# EAGLE design design (EAGLE 7.3.0)
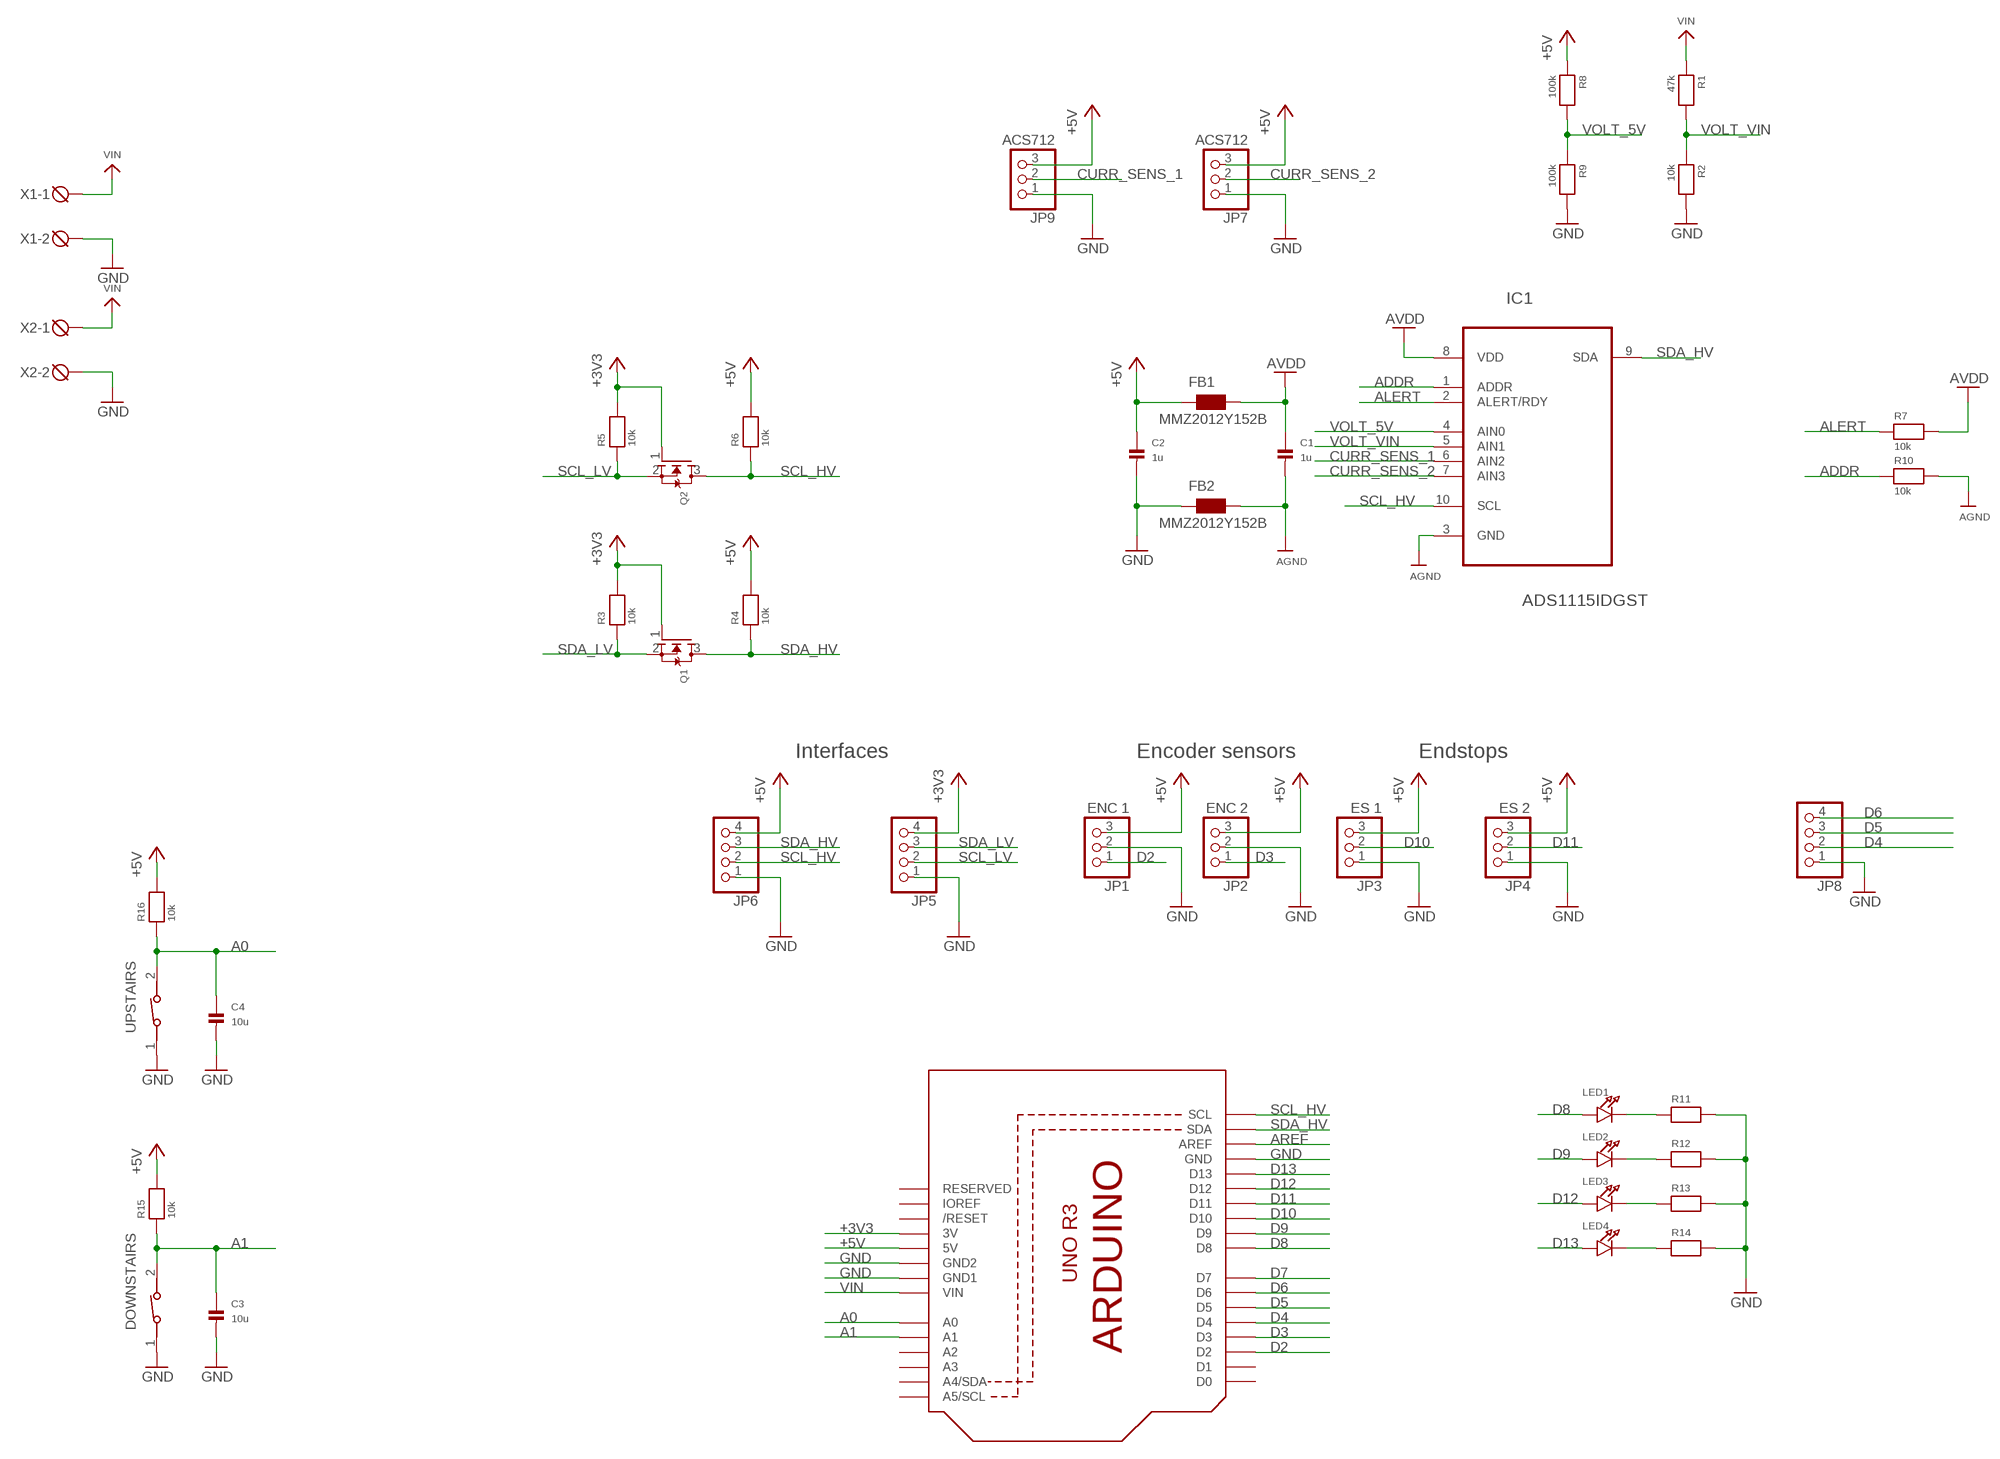
[diagram p0: schematic, sheet 1]

## Parts
C1  1u  CAP_CERAMIC0805  [0805]
C2  1u  CAP_CERAMIC0805  [0805]
C3  10u  CAP_CERAMIC0805  [0805]
C4  10u  CAP_CERAMIC0805  [0805]
DOWNSTAIRS  434111043826  [434111043826]
FB1  MMZ2012Y152B  WE-CBF_0805  [0805]
FB2  MMZ2012Y152B  WE-CBF_0805  [0805]
IC1  ADS1115IDGST  [SOP50P490X110-10N]
JP1  ENC 1  HEADER-1X3ROUND  [1X03_ROUND]
JP2  ENC 2  HEADER-1X3ROUND  [1X03_ROUND]
JP3  ES 1  HEADER-1X3ROUND  [1X03_ROUND]
JP4  ES 2  HEADER-1X3ROUND  [1X03_ROUND]
JP5  HEADER-1X4ROUND  [1X04_ROUND]
JP6  HEADER-1X4ROUND  [1X04_ROUND]
JP7  ACS712  HEADER-1X3ROUND  [1X03_ROUND]
JP8  HEADER-1X4ROUND  [1X04_ROUND]
JP9  ACS712  HEADER-1X3ROUND  [1X03_ROUND]
LED1  LED0805  [CHIPLED_0805]
LED2  LED0805  [CHIPLED_0805]
LED3  LED0805  [CHIPLED_0805]
LED4  LED0805  [CHIPLED_0805]
Q1  MOSFET-NWIDE  [SOT23-WIDE]
Q2  MOSFET-NWIDE  [SOT23-WIDE]
R1  47k  RESISTOR0603  [0603]
R2  10k  RESISTOR0603  [0603]
R3  10k  RESISTOR0603  [0603]
R4  10k  RESISTOR0603  [0603]
R5  10k  RESISTOR0603  [0603]
R6  10k  RESISTOR0603  [0603]
R7  10k  RESISTOR0603  [0603]
R8  100k  RESISTOR0603  [0603]
R9  100k  RESISTOR0603  [0603]
R10  10k  RESISTOR0603  [0603]
R11  RESISTOR0603  [0603]
R12  RESISTOR0603  [0603]
R13  RESISTOR0603  [0603]
R14  RESISTOR0603  [0603]
R15  10k  RESISTOR0603  [0603]
R16  10k  RESISTOR0603  [0603]
U1  ARDUINOR3NODIM  [ARDUINOR3-NODIM]
UPSTAIRS  434111043826  [434111043826]
X1  DG3XX-02-5.0  [DG306-5.0-02P]
X2  DG3XX-02-5.0  [DG306-5.0-02P]

## Nets
+3V3: JP5.4 Q1.1(G) Q2.1(G) R3.2 R5.2 U1.3V
+5V: C2.1 FB1.1 JP1.3 JP2.3 JP3.3 JP4.3 JP6.4 JP7.3 JP9.3 R4.2 R6.2 R8.1 R15.2 R16.2 U1.5V
A0: C4.1 R16.1 U1.A0 UPSTAIRS.2
A1: C3.1 DOWNSTAIRS.2 R15.1 U1.A1
ADDR: IC1.1(ADDR) R10.1
AGND: C1.2 FB2.2 IC1.3(GND) R10.2
ALERT: IC1.2(ALERT/RDY) R7.1
AREF: U1.AREF
AVDD: C1.1 FB1.2 IC1.8(VDD) R7.2
CURR_SENS_1: IC1.6(AIN2) JP9.2
CURR_SENS_2: IC1.7(AIN3) JP7.2
D2: JP1.1 U1.D2
D3: JP2.1 U1.D3
D4: JP8.2 U1.D4
D5: JP8.3 U1.D5
D6: JP8.4 U1.D6
D7: U1.D7
D8: LED1.A U1.D8
D9: LED2.A U1.D9
D10: JP3.2 U1.D10
D11: JP4.2 U1.D11
D12: LED3.A U1.D12
D13: LED4.A U1.D13
GND: C2.2 C3.2 C4.2 DOWNSTAIRS.1 FB2.1 JP1.2 JP2.2 JP3.1 JP4.1 JP5.1 JP6.1 JP7.1 JP8.1 JP9.1 R2.2 R9.2 R11.2 R12.2 R13.2 R14.2 U1.GND U1.GND1 U1.GND2 UPSTAIRS.1 X1.2 X2.2
N$1: LED1.C R11.1
N$2: LED2.C R12.1
N$3: LED3.C R13.1
N$4: LED4.C R14.1
SCL_HV: IC1.10(SCL) JP6.2 Q2.3(D) R6.1 U1.SCL
SCL_LV: JP5.2 Q2.2(S) R5.1
SDA_HV: IC1.9(SDA) JP6.3 Q1.3(D) R4.1 U1.SDA
SDA_LV: JP5.3 Q1.2(S) R3.1
VIN: R1.1 U1.VIN X1.1 X2.1
VOLT_5V: IC1.4(AIN0) R8.2 R9.1
VOLT_VIN: IC1.5(AIN1) R1.2 R2.1
Unconnected: U1.A2 U1.A3 U1.A4(A4/SDA) U1.A5(A5/SCL) U1.D0 U1.D1 U1.IOREF U1.RESERVED U1.RESET(/RESET)

## Notes on the sheet
- Interfaces | Encoder sensors | Endstops

## Library data of the parts
C1-C4 = microbuilder:CAP_CERAMIC: Ceramic Capacitors 0402 - 0402 Surface Mount Capacitors 16pF 50V 5% [Digikey: 445-4899-2-ND] 18pF 50V 5% [Digikey: 490-1281-2-ND] 22pF 50V 5% [Digikey: 490-1283-2-ND] 68pF 50V 5% [Digikey: 490-1289-2-ND] 0.1uF 10V 10% [Digikey: 490-1318-2-ND] 1.0uF 6.3V 10% [Digikey: 490-1320-2-ND] 0603 - 0603 Surface Mount Capacitors 16 pF 50V 5% [Digikey: 445-5051-2-ND] 22 pF 50V [Digikey: PCC220ACVTR-ND] 33 pF 50V 5% [Digikey: 490-1415-1-ND] 56pF 50V 5% [Digikey: 490-1421-1-ND] 220pF 50V 5% [Digikey: 445-1285-1-ND] 680 pF 50V 2200 pF 50V 5% C0G [Digikey: 445-1297-1-ND] 5600 pF 100V 5% X7R [Digikey: 478-3711-1-ND] 0.1 µF 25V 10% [Digikey: PCC2277TR-ND] 0.22 µF 16V 10% X7R [Digikey: 445-1318-1-ND] 1.0 µF 25V 10% [Digikey: 445-5146-2-ND] 0603 - RF Specific 3pF 250V +/-0.1pF RF [Digikey: 712-1347-1-ND] 18 pF 250V 5% [Digikey: 478-3505-1-ND or 712-1322-1-ND] 56 pF 250V 5% C0G RF [Digikey: 490-4867-1-ND] 68 pF 250V RF [Digikey: 490-4868-1-ND] 0805 - 0805 Surface Mount Capacitors 220 pF 250V 2% RF Ceramic Capacitor [Digikey: 712-1398-1-ND] 1000 pF 50V 2% NP0 Ceramic Capacitor [Digikey: 478-3760-1-ND] 0.1 µF 25V 10% Ceramic Capacitor [Digikey: PCC1828TR-ND] 1.0 µF 16V 10% Ceramic Capacitor[Digikey: 490-1691-2-ND] 10.0 µF 10V 10% Ceramic Capacitor[Digikey: 709-1228-1-ND] 10.0 uF 16V 10% Ceramic Capacitor [Digikey: 478-5165-2-ND] 47 uF 6.3V 20% Ceramic Capacitor [Digikey: 587-1779-1-ND or 399-5506-1-ND] 1206 - 1206 Surface Mount Capacitors 47uF 10V 20% Ceramic Capacitor [Digikey: 490-5528-1-ND or 399-5508-1-ND or 445-6010-1-ND] 100uF 6.3V -20%, +80% Y5V Ceramic Capacitor (Digikey: 490-4512-1-ND, Mouser: 81-GRM31CF50J107ZE1L)
DOWNSTAIRS UPSTAIRS = Eagle_SWITCHES (rev18c):434111043826: 6.0x3.5 mm SMD WS-TASV <http://katalog.we-online.de/media/images/v2/Family_WS-TASV_6.0x3.jpg> Details see: http://katalog.we-online.de/em/datasheet/4341x1xxx8x6.pdf 2015 (C) Wurth Elektronik
FB1 FB2 = wuerth-elektronik:WE-CBF: SMD EMI Suppression Ferrite Beads - excellent anti-EMI properties - low DCR - impedances till 3000 ohms - rated current up to 6 A
IC1 = ADS1115IDGST:ADS1115IDGST: Analog-to-Digital Converter with Internal Reference; AVAILABILITY: Unavailable; DESCRIPTION: 16-Bit ADC with Integrated MUX, PGA, Comparator, Oscillator, and Reference 10-VSSOP -40 to 125; MF: Texas Instruments; MP: ADS1115IDGST; PACKAGE: MSOP-10 Texas Instruments; PRICE: None
JP1-JP4 JP7 JP9 = microbuilder:HEADER-1X3: PIN HEADER
JP5 JP6 JP8 = microbuilder:HEADER-1X4: PIN HEADER
LED1-LED4 = microbuilder:LED: LED 0603 - 0603 Surface Mount Package 2mA: Green LED - Low Power (3.9mcd, 2ma, 1.7Vf) - Digikey: 475-2709-2-ND Orange LED - Low Power (9.8mcd, 2ma, 1.8Vf) - Digikey: 475-1194-2-ND Red LED - Low Power (5mcd, 2ma, 1.8Vf) - Digikey: 475-1195-2-ND Yellow LED - Low Power (7mcd, 2ma, 1.8Vf) - Digikey: 475-1196-2-ND 5mA: Blue LED - Low Power (17mcd, 5ma, 2.9Vf) - Digikey: LNJ937W8CRACT-ND 0805 - 0805 Surface Mount Package 2mA: Red LED (8.8mcd, 2mA, 1.8Vf, Clear) - Low Power [Digikey: 475-2510-1-ND] Green LED (5mcd, 2mA, 1.8Vf, Clear) - Low Power [Digikey: 475-2730-1-ND] Yellow LED (11.3mcd, 2mA, 1.8Vf, Clear) - Low Power [Digikey: 475-2555-1-ND] 20mA: Red LED (104mcd, 20mA, Diffused) - LS R976 [Digikey: 475-1278-6-ND] Red LED (12mcd, 20mA, 2.0Vf, Clear) - APT2012EC [Digikey: 754-1128-1-ND] Green LED (15mcd, 20mA, 2.2Vf, Clear) - APT2012GC [Digikey: 754-1131-1-ND] Orange LED (160mcd, 20mA, 2.1Vf, Clear) - APT2012SECK [Digikey: 754-1130-1-ND] 1206 - 1206 Surface Mount Package Green LED (26mcd, 20mA, Diffused) - LG N971 [Digikey: 475-1407-6-ND] Red LED (15mcd, 20mA, Diffused) - LH N974 [Digikey: 475-1416-6-ND]
Q1 Q2 = microbuilder:MOSFET-N: N-Channel Mosfet LEGEND VDS: Voltage Drain-Source ID: Drain Current RDS(ON): Drain-Source On-State Resistance VGS(TH): Gate-Source Threshold Voltage CISS: Drain-Source Input Capacitance SOT-23 Name VDS ID RDS(ON) VGS(TH) CISS Order Number 2N7002E 60V 260mA 2.5 Ohm 2.5V @ 250uA 26.7pF @ 25V 2N7002ET1GOSTR-ND BSH103 30V 850mA 400 mOhm 400mV @ 1mA 83pF @ 24V BSH103,235-ND BSS138 60V 320mA 1.6 Ohm 1.5V @ 250uA 50pF @ 10V Mouser: 771-BSS138PW115 DMN2075U-7 20V 4.2A 38 mOhm 1V @ 250 uA 594.3pF @ 10V DMN2075U-7DICT-ND * BSS138 good choice for I2C level-shifting
R1-R16 = microbuilder:RESISTOR: Resistors 0402 - 0402 Surface Mount Package 22 Ohm 1% 1/16W [Digikey: 311-22.0LRTR-ND] 33 Ohm 5% 1/16W 1.0K 5% 1/16W 1.5K 5% 1/16W 2.0K 1% 1/16W 10.0K 1% 1/16W [Digikey: 311-10.0KLRTR-ND] 10.0K 5% 1/16W [Digikey: RMCF0402JT10K0TR-ND] 12.1K 1% 1/16W [Digikey: 311-22.0LRTR-ND] 100.0K 5% 1/16W 0603 - 0603 Surface Mount Package 0 Ohm 1/10 Watt 1% Resistor 15 Ohm 1/10 Watt 1% Resistor 33 Ohm 1/10 Watt 1% Resistor 49.9 Ohm 1/10 Watt 1% Resistor 100 Ohm 1/10 Watt 1% Resistor 150 Ohm 1/10 Watt 1% Resistor 240 Ohm 1/10 Watt 1% Resistor 390 Ohm 1/10 Watt 1% Resistor 560 Ohm 1/10 Watt 1% Resistor 680 Ohm 1/10 Watt 1% Resistor 750 Ohm 1/10 Watt 1% Resistor 1.0K Ohm 1/10 Watt 1% Resistor 1.5K Ohm 1/10 Watt 1% Resistor 2.0K Ohm 1/10 Watt 1% Resistor 2.2K Ohm 1/10 Watt 1% Resistor 3.3K Ohm 1/10 Watt 1% Resistor 4.7K Ohm 1/10 Watt 1% Resistor 10.0K Ohm 1/10 Watt 1% Resistor 12.0K Ohm 1/10 Watt 1% Resistor 12.1K Ohm 1/10 Watt 1% Resistor 20.0K Ohm 1/10 Watt 1% Resistor 33.0K Ohm 1/10 Watt 1% Resistor 100.0K Ohm 1/10 Watt 1% Resistor 0805 - 0805 Surface Mount Package 0 Ohm 1/8 Watt 1% Resistor 33 Ohm 1/8 Watt 1% Resistor 100 Ohm 1/8 Watt 1% Resistor 150 Ohm 1/8 Watt 1% Resistor 200 Ohm 1/8 Watt 1% Resistor 240 Ohm 1/8 Watt 1% Resistor 330 Ohm 1/8 Watt 1% Resistor 390 Ohm 1/8 Watt 1% Resistor 470 Ohm 1/8 Watt 1% Resistor 1.0K Ohm 1/8 Watt 1% Resistor 1.5K Ohm 1/8 Watt 1% Resistor 2.0K Ohm 1/8 Watt 1% Resistor 4.7K Ohm 1/8 Watt 1% Resistor 5.1K Ohm 1/8 Watt 1% Resistor 5.6K Ohm 1/8 Watt 1% Resistor 10.0K Ohm 1/8 Watt 1% Resistor 22.0K Ohm 1/8 Watt 1% Resistor 33.0K Ohm 1/8 Watt 1% Resistor 100K Ohm 1/8 Watt 1% Resistor 1206 - 1206 Surface Mount Package 2012 - 2010 Surface Mount Package 0.11 Ohm 1/2 Watt 1% Resistor - Digikey: RHM.11UCT-ND
U1 = microbuilder:ARDUINOR3: This is a new object for the new Arduino R3 - with extra pins that you may want to use (such as IOref, and duplicated A4/A5
X1 X2 = degson:DG3XX-02: DG350-3.5-02P DG306-5.0-02P

## Board
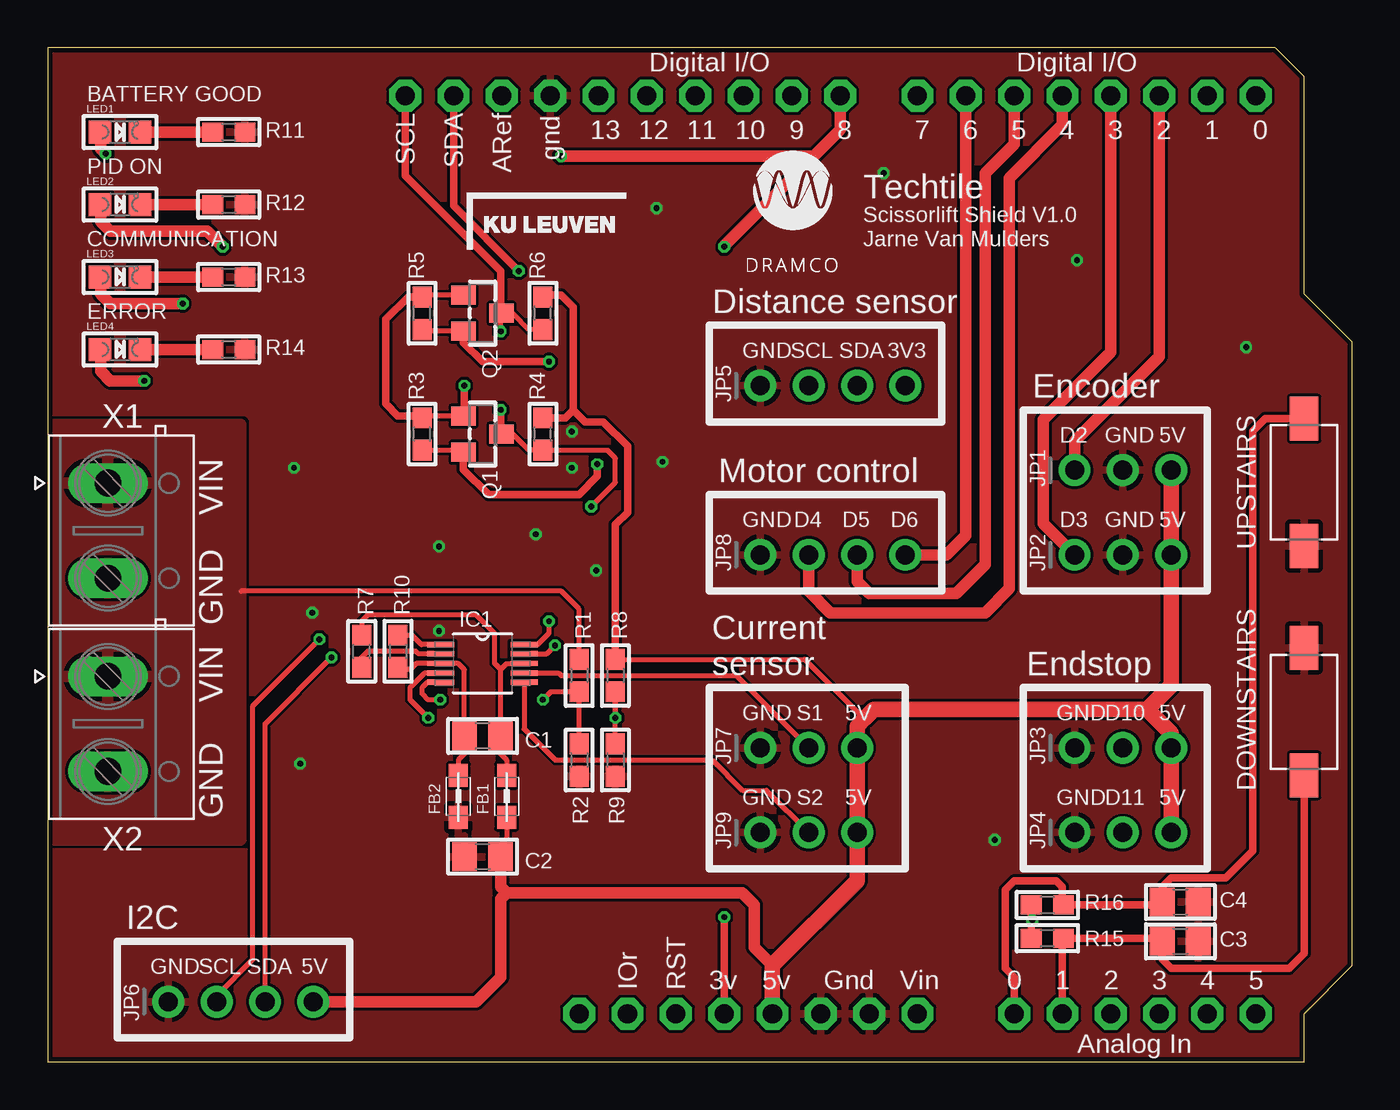
[diagram p1: board, top side]
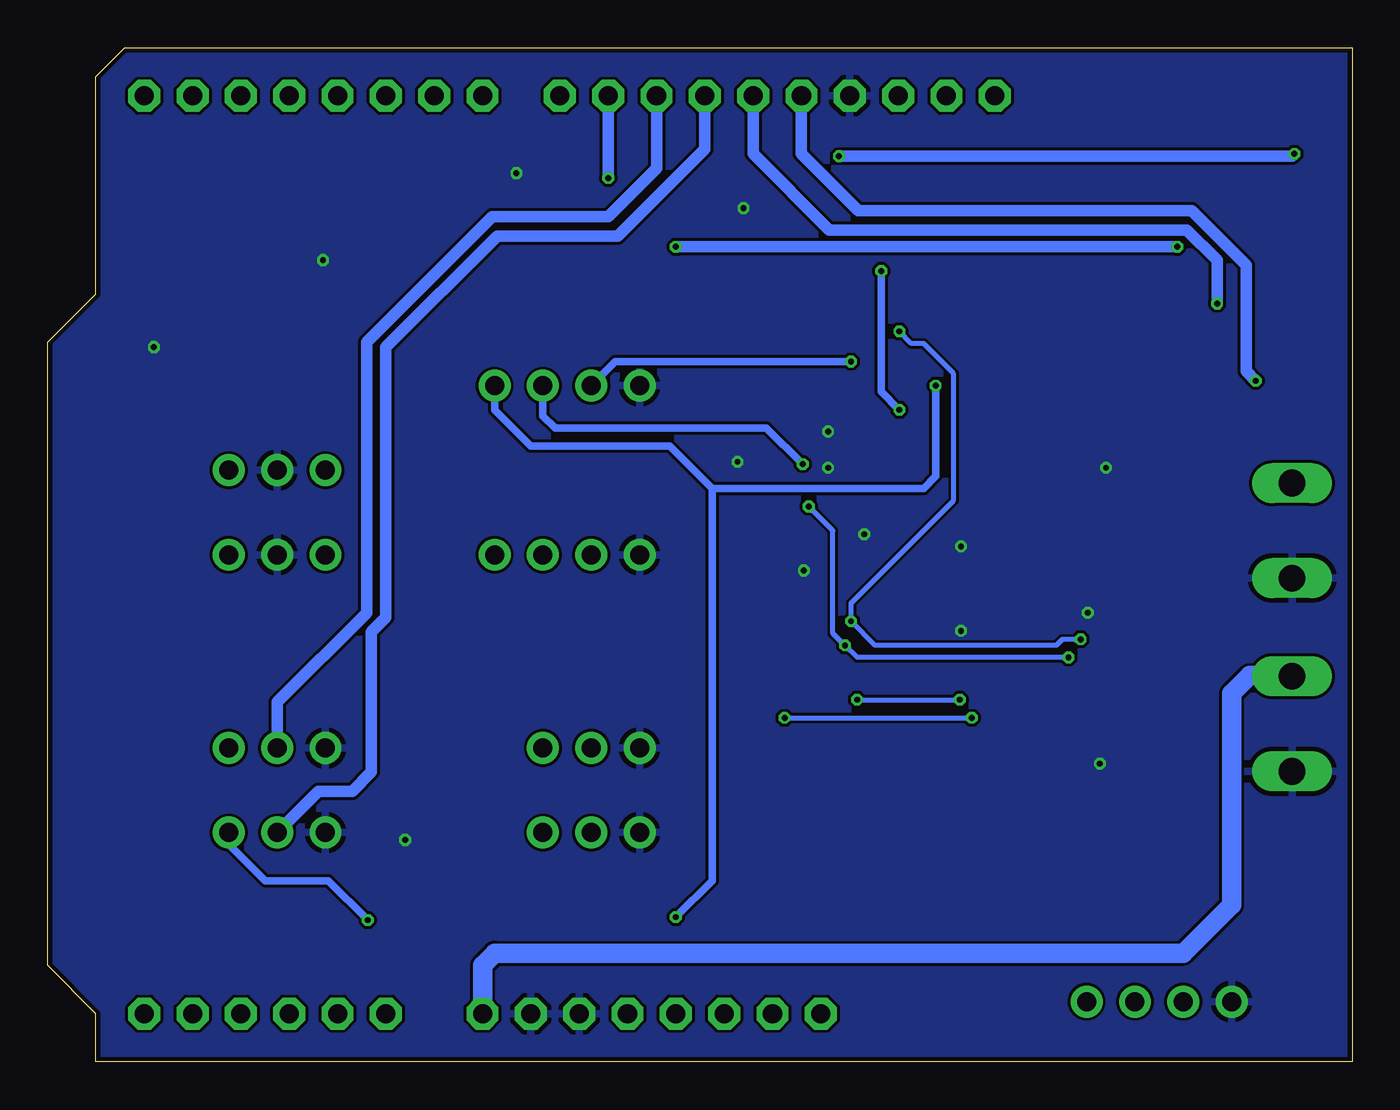
[diagram p2: board, bottom side, seen from below]

Size 68.58 x 53.34 mm. Coordinates in mm from the lower left corner, seen from the top.
Outline: 0,0 66.04,0 66.04,2.54 68.58,5.08 68.58,37.85 66.04,40.39 66.04,51.82 64.52,53.34 0,53.34 0,0
Copper layers (1*16): Top 0.035mm / dielectric 1.5mm / Bottom 0.035mm
Design rules "SeeedStudio_2layer_DRU_no_angle_20140221-2": minimum track width 6mil, minimum drill 12mil, track to track 6mil, track to pad 6mil, pad to pad 6mil, via to via 6mil, smd to smd 0mil, copper to edge 10mil, drill to drill 10mil, minimum pad ring 10mil, minimum via ring 6mil, stop-mask expansion 2mil, vias tented up to drill 100mil, thermal gap 10mil

### Footprints (pad centres in the part's own frame; a part is rotated, then mirrored left to right if it is on the bottom)
0805 = smd 1.3 x 1.5: 1 -0.95,0; 2 0.95,0
434111043826 = smd 2.3 x 1.5: 1 -3.35,0; 2 3.35,0
0805' = smd 1.2 x 1: 1 -1.1,0; 2 1.1,0
SOP50P490X110-10N = smd 1.422 x 0.279: 1 -2.184,0.991; 2 -2.184,0.508; 3 -2.184,0; 4 -2.184,-0.508; 5 -2.184,-0.991; 6 2.184,-0.991; 7 2.184,-0.508; 8 2.184,0; 9 2.184,0.508; 10 2.184,0.991
1X03_ROUND = drill 1 pad 1.676: 1 -2.54,0; 2 0,0; 3 2.54,0
1X04_ROUND = drill 1 pad 1.676: 1 -3.81,0; 2 -1.27,0; 3 1.27,0; 4 3.81,0
CHIPLED_0805 = smd 1.2 x 1.2: A 0,-1.05; C 0,1.05
SOT23-WIDE = smd 1 x 1.27: 1 -0.95,-1; 2 0.95,-1; 3 0,1
0603 = smd 1.1 x 1: 1 -0.85,0; 2 0.85,0
ARDUINOR3-NODIM = drill 1 pad 1.676 octagon: 3V 35.56,2.54; 5V 38.1,2.54; A0 50.8,2.54; A1 53.34,2.54; A2 55.88,2.54; A3 58.42,2.54; A4 60.96,2.54; A5 63.5,2.54; AREF 23.876,50.8; D0 63.5,50.8; D1 60.96,50.8; D2 58.42,50.8; D3 55.88,50.8; D4 53.34,50.8; D5 50.8,50.8; D6 48.26,50.8; D7 45.72,50.8; D8 41.656,50.8; D9 39.116,50.8; D10 36.576,50.8; D11 34.036,50.8; D12 31.496,50.8; D13 28.956,50.8; GND 26.416,50.8; GND1 43.18,2.54; GND2 40.64,2.54; IOREF 30.48,2.54; RESERVED 27.94,2.54; RESET 33.02,2.54; SCL 18.796,50.8; SDA 21.336,50.8; VIN 45.72,2.54
DG306-5.0-02P = drill 1.4 long: 1 -2.5,0; 2 2.5,0

### Placement (x,y rotation side)
C1  22.86,17.14 180 top
C2  22.86,10.79 180 top
C3  59.53,6.35 0 top
C4  59.53,8.41 0 top
DOWNSTAIRS  66.04,18.41 270 top
FB1  MMZ2012Y152B  [0805']  24.13,13.97 90 top
FB2  MMZ2012Y152B  [0805']  21.59,13.97 90 top
IC1  22.86,20.95 0 top
JP1  56.52,31.11 0 top
JP2  56.52,26.67 0 top
JP3  56.52,16.51 0 top
JP4  56.52,12.06 0 top
JP5  41.27,35.56 0 top
JP6  10.16,3.17 0 top
JP7  40.01,16.51 0 top
JP8  41.27,26.67 0 top
JP9  40.01,12.06 0 top
LED1  3.81,48.9 270 top
LED2  3.81,45.09 270 top
LED3  3.81,41.27 270 top
LED4  3.81,37.47 270 top
Q1  22.86,33.02 270 top
Q2  22.86,39.37 270 top
R1  27.94,20.32 270 top
R2  27.94,15.88 270 top
R3  19.68,33.02 90 top
R4  26.04,33.02 90 top
R5  19.68,39.37 90 top
R6  26.04,39.37 90 top
R7  16.51,21.59 90 top
R8  29.84,20.32 270 top
R9  29.84,15.88 270 top
R10  18.41,21.59 270 top
R11  9.53,48.9 0 top
R12  9.53,45.09 0 top
R13  9.53,41.27 0 top
R14  9.53,37.47 0 top
R15  52.55,6.51 180 top
R16  52.55,8.26 180 top
U1  0,0 0 top
UPSTAIRS  66.04,30.48 90 top
X1  3.17,27.94 270 top
X2  3.17,17.78 270 top

### Tracks (layer width: path | path; a pad name or v marks a point on that pad's centre or on a via)
+3V3  (via drill 0.31)
  Top 0.254: Q1.1 19.79,33.97 R3.2 | Q2.1 19.79,40.32 R5.2
  Top 0.406: R5.2 18.95,40.22 17.78,39.05 17.78,34.61 18.41,33.97 19.58,33.97 R3.2 | v35.56,7.62 U1.3V | v21.91,35.56 21.91,34.02 Q1.1
  Bottom 0.406: JP5.4 45.09,34.29 43.18,32.38 35.88,32.38 33.66,30.16 | 33.66,30.16 33.66,9.53 v35.56,7.62 | 33.66,30.16 22.54,30.16 21.91,30.8 v21.91,35.56
+5V  (via drill 0.31)
  Top 0.254: FB1.1 24.13,11.75 23.81,11.43 C2.1 | R8.1 39.79,21.17 42.93,18.03
  Top 0.406: R8.1 29.84,28.26 30.48,28.89 30.48,32.38 29.21,33.66 28.26,33.66 27.62,34.29 | R4.2 27.2,33.87 27.62,34.29 | 27.62,34.29 27.62,39.69 26.99,40.32 26.14,40.32 R6.2 | R16.2 51.7,7.46 | 51.7,7.46 R15.2 | v51.75,7.46 51.7,7.46
  Top 0.61: 38.1,5.08 37.15,6.03 37.15,8.26 36.51,8.89 24.13,8.89 | 24.13,8.89 23.81,9.21 C2.1 | JP6.4 22.54,3.17 23.81,4.45 23.81,8.57 24.13,8.89
  Top 0.813: U1.5V 38.1,5.08 42.55,9.53 JP9.3 JP7.3 42.55,17.65 42.93,18.03 43.43,18.54 57.78,18.54 | JP4.3 JP3.3 59.05,17.27 57.78,18.54 | JP1.3 JP2.3 59.05,19.81 57.78,18.54
  Bottom 0.406: JP4.3 59.05,11.43 57.15,9.53 53.82,9.53 v51.75,7.46
A0
  Top 0.406: U1.A0 50.8,4.45 50.32,4.92 50.32,9.05 50.8,9.53 53.02,9.53 53.34,9.21 53.34,8.31 R16.1 58.42,8.26 C4.1 58.58,9.21 59.05,9.68 61.91,9.68 63.34,11.11 63.34,33.18 63.99,33.83 UPSTAIRS.2
A1
  Top 0.406: U1.A1 53.34,6.45 R15.1 58.42,6.51 C3.1 58.58,5.39 59.05,4.92 65.25,4.92 66.04,5.71 DOWNSTAIRS.2
ADDR
  Top 0.254: IC1.1 19.65,21.95 19.15,22.44 R10.1
AGND
  Top 0.254: R10.2 18.52,20.64 19.05,20.64 19.37,20.95 IC1.3 21.59,20.95 21.91,20.64 C1.2 21.91,16.2 21.59,15.88 FB2.2
ALERT
  Top 0.254: IC1.2 19.49,21.46 19.37,21.59 16.83,21.59 16.51,21.27 R7.1
AVDD
  Top 0.254: 23.81,20.64 C1.1 23.81,16.2 24.13,15.88 FB1.2 | 23.81,20.64 24.13,20.95 IC1.8 | 23.81,20.64 23.5,20.95 23.5,22.54 22.54,23.5 16.83,23.5 16.51,23.18 R7.2
CURR_SENS_1
  Top 0.254: IC1.6 25.04,17.5 26.67,15.88 34.92,15.88 36.51,14.29 37.78,14.29 JP9.2
CURR_SENS_2
  Top 0.254: IC1.7 26.86,20.45 26.99,20.32 36.2,20.32 JP7.2
D2
  Top 0.61: JP1.1 53.98,32.64 58.42,37.08 U1.D2
D3
  Top 0.61: U1.D3 55.88,37.34 52.32,33.78 52.32,28.32 JP2.1
D4
  Top 0.61: JP8.2 40.01,24.77 41.15,23.62 49.28,23.62 50.55,24.89 50.55,46.48 53.34,49.28 U1.D4
D5
  Top 0.61: JP8.3 42.55,25.27 43.18,24.64 47.75,24.64 49.28,26.16 49.28,46.74 50.8,48.26 U1.D5
D6
  Top 0.61: U1.D6 48.26,27.69 47.24,26.67 JP8.4
D8  (via drill 0.31)
  Top 0.61: U1.D8 41.66,49.02 40.26,47.62 v26.99,47.62 | v3.05,47.75 2.79,48.01 2.79,48.86 LED1.A
  Bottom 0.61: v3.05,47.75 3.17,47.62 v26.99,47.62
D9  (via drill 0.31)
  Top 0.61: v39.12,46.48 35.56,42.93 v35.56,42.86 | LED2.A 2.79,45.05 2.79,44.2 3.3,43.69 8.38,43.69 v9.21,42.86
  Bottom 0.61: U1.D9 v39.12,46.48 | v9.21,42.86 v35.56,42.86
D10
  Bottom 0.61: U1.D10 36.58,46.99 39.12,44.45 45.21,44.45 51.82,37.85 51.82,23.62 56.52,18.92 JP3.2
D11
  Bottom 0.61: U1.D11 34.04,48.01 38.61,43.43 44.96,43.43 50.8,37.59 50.8,23.37 51.56,22.61 51.56,15.24 52.58,14.22 54.36,14.22 JP4.2
D12  (via drill 0.31)
  Top 0.61: v7.11,39.88 3.3,39.88 2.79,40.39 2.79,41.24 LED3.A
  Bottom 0.61: U1.D12 31.5,47.75 27.5,43.75 8.7,43.75 7.11,42.16 v7.11,39.88
D13  (via drill 0.31)
  Top 0.61: v5.08,35.81 3.3,35.81 2.79,36.32 2.79,37.43 LED4.A
  Bottom 0.61: U1.D13 28.96,47.75 25.97,44.77 8.45,44.77 5.59,41.91 5.59,36.32 v5.08,35.81
GND  (via drill 0.31)
  other vias: 12.95,31.24 62.99,37.59 54.1,42.16 43.94,46.74 49.78,11.68 13.27,15.68 32,44.89 27.56,31.24 27.56,33.15 32.32,31.56 25.65,27.75 13.91,23.62 20.57,27.11 28.83,25.84 20.57,22.67
  pour Bottom: -7.62,63.5 76.83,63.5 76.83,-7.62 -7.62,-7.62
  pour Top (rank 6): -12.06,69.22 87.63,69.22 87.63,-19.05 -12.06,-19.05
N$1
  Top 0.61: R11.1 LED1.C
N$2
  Top 0.61: R12.1 LED2.C
N$3
  Top 0.61: R13.1 LED3.C
N$4
  Top 0.61: R14.1 LED4.C
SCL_HV  (via drill 0.31)
  Top 0.254: R6.1 25.3,38.52 24.45,39.37 Q2.3 23.81,39.32 v23.81,38.42 | JP6.2 8.89,3.49 10.79,5.4 10.79,18.73 v14.29,22.23 | v26.35,23.18 26.35,22.54 25.76,21.95 IC1.10
  Top 0.406: U1.SCL 18.8,46.61 23.81,41.59 23.81,39.42 Q2.3
  Bottom 0.254: v14.29,22.23 15.24,22.23 15.56,21.91 25.08,21.91 v26.35,23.18 26.35,24.13 20.95,29.53 20.95,36.2 22.54,37.78 23.18,37.78 v23.81,38.42
SCL_LV  (via drill 0.31)
  Top 0.254: Q2.2 19.79,38.42 R5.1
  Top 0.406: Q2.2 21.86,37.83 22.86,36.83 v26.35,36.83
  Bottom 0.406: v26.35,36.83 38.73,36.83 JP5.2
SDA_HV  (via drill 0.31)
  Top 0.254: Q1.3 24.45,33.02 25.3,32.17 R4.1 29.43,32.17 29.84,31.75 29.84,30.48 v28.57,29.21 | JP6.3 11.43,17.78 v14.92,21.27 | IC1.9 26.23,21.46 v26.67,21.91
  Top 0.406: U1.SDA 21.34,45.02 v24.77,41.59 | v23.81,34.29 23.81,33.07 Q1.3
  Bottom 0.254: v14.92,21.27 26.04,21.27 v26.67,21.91 27.3,22.54 27.3,27.94 v28.57,29.21
  Bottom 0.406: v24.77,41.59 24.77,35.24 v23.81,34.29
SDA_LV  (via drill 0.31)
  Top 0.254: R3.1 21.76,32.17 Q1.2
  Top 0.406: Q1.2 21.86,31.16 23.18,29.84 27.94,29.84 28.89,30.8 v28.89,31.43
  Bottom 0.406: JP5.3 42.55,33.97 41.91,33.34 30.8,33.34 v28.89,31.43
VIN
  Top 0.254: R1.1 27.94,23.81 26.99,24.77 10.16,24.77
  Bottom 1.016: U1.VIN 45.72,5.08 45.09,5.71 8.89,5.71 6.35,8.26 6.35,19.37 5.4,20.32 3.21,20.32 X2.1
  pour Top: 1.02,33.53 10.16,33.53 10.16,11.68 -1.78,11.68 -1.78,33.53
VOLT_5V  (via drill 0.31)
  Top 0.254: R9.1 R8.2 v29.84,18.1 | v20,18.1 19.05,19.05 19.05,19.68 19.81,20.45 IC1.4
  Bottom 0.254: v29.84,18.1 v20,18.1
VOLT_VIN  (via drill 0.31)
  Top 0.254: R2.1 R1.2 26.45,19.47 v26.04,19.05 | v20.64,19.05 20,19.05 19.68,19.37 19.68,19.68 19.96,19.96 IC1.5
  Bottom 0.254: v26.04,19.05 v20.64,19.05

### Text on the board
tPlace: Techtile | Scissorlift Shield V1.0 | Jarne Van Mulders | C:/Users/Jarne/Box/Werk/Templates/logo s/logo-text-black.bmp' | VIN | GND | VIN | GND
tNames: BATTERY GOOD | PID ON | COMMUNICATION | ERROR | Distance sensor | GND | SCL | SDA | 3V3 | Encoder | D2 | GND | 5V | Motor control | GND | D4 | D5 | D6 | D3 | GND | 5V | Current / sensor | Endstop | GND | S1 | 5V | GND | D10 | 5V | GND | S2 | 5V | GND | D11 | 5V | I2C | GND | SCL | SDA | 5V